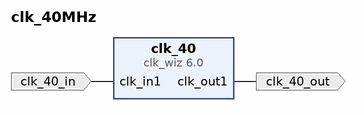
[diagram p0: block diagram of the top level]
# Vivado block design clk_40MHz, xc7z010clg400-1, Vivado 2018.2
create_bd_design clk_40MHz

create_bd_port -dir I -type clk clk_40_in
set_property -dict {CONFIG.FREQ_HZ 125000000} [get_bd_ports clk_40_in]
create_bd_port -dir O -type clk clk_40_out
set_property -dict {CONFIG.FREQ_HZ 40000000} [get_bd_ports clk_40_out]

create_bd_cell -type ip -vlnv xilinx.com:ip:clk_wiz:6.0 clk_40
set_property -dict [list \
  CONFIG.CLKOUT1_REQUESTED_OUT_FREQ 40.000 \
  CONFIG.USE_LOCKED false \
  CONFIG.USE_RESET false \
  CONFIG.MMCM_DIVCLK_DIVIDE 1 \
  CONFIG.MMCM_CLKOUT0_DIVIDE_F 25.000 \
  CONFIG.CLKOUT1_JITTER 150.675 \
] [get_bd_cells clk_40]

# ---- connections ----

connect_bd_net -net clk_in1_0_1 [get_bd_ports clk_40_in] [get_bd_pins clk_40/clk_in1]
connect_bd_net -net clk_wiz_0_clk_out1 [get_bd_pins clk_40/clk_out1] [get_bd_ports clk_40_out]

validate_bd_design
save_bd_design
